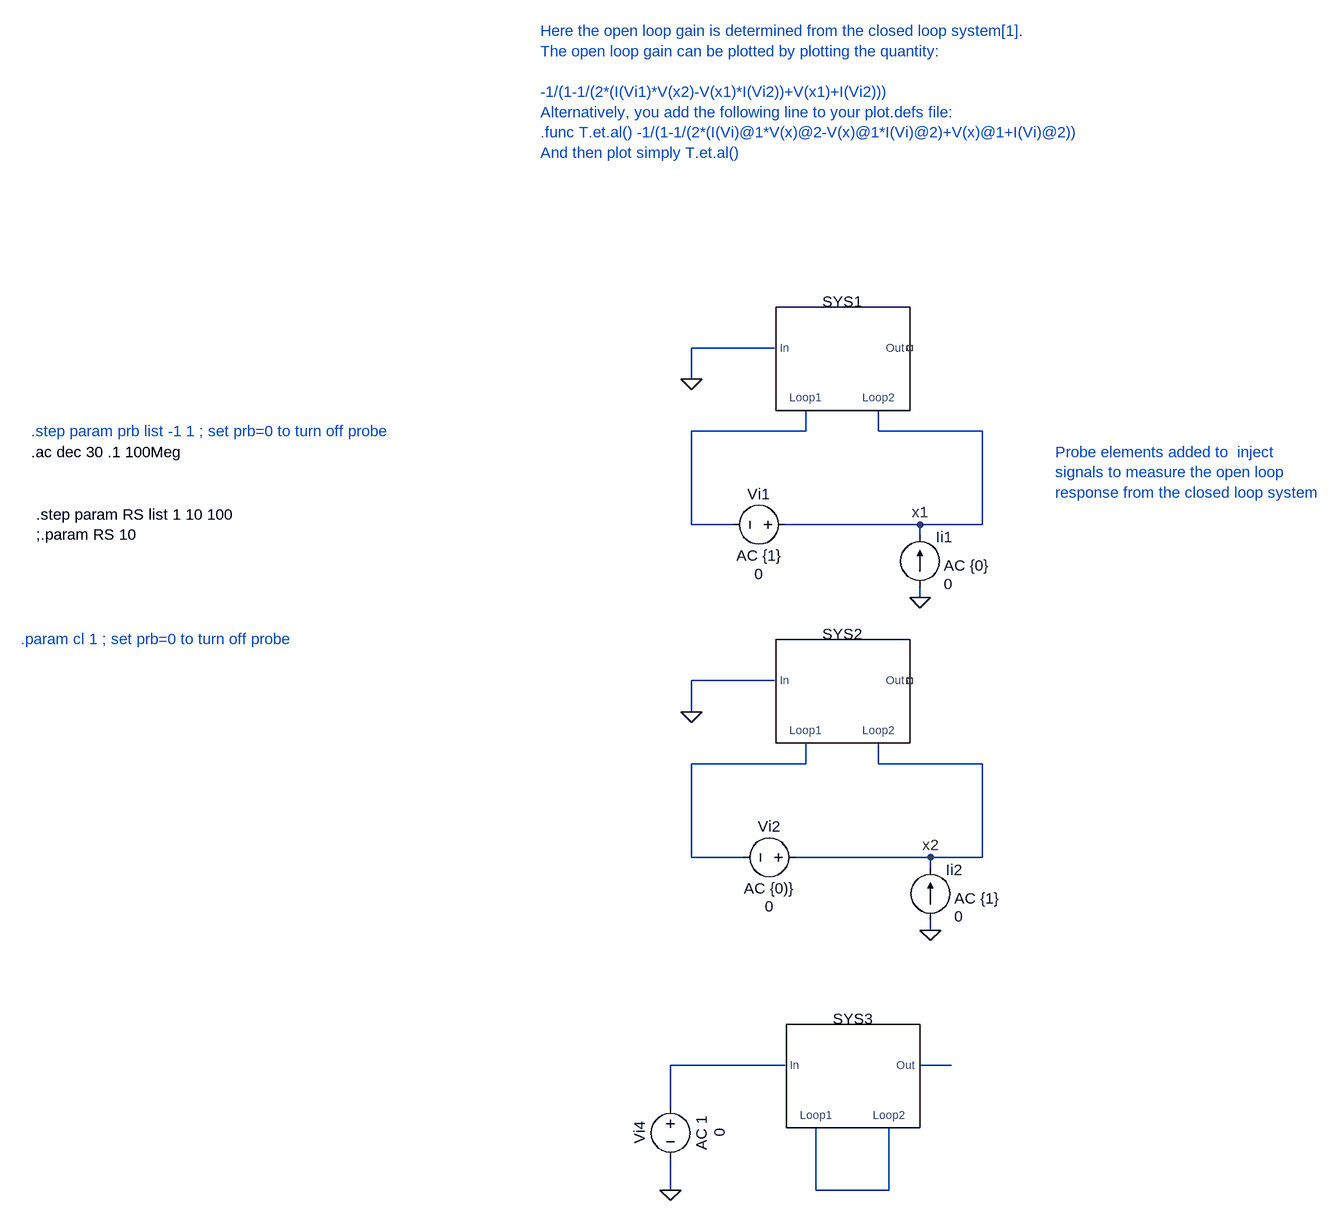
[diagram p0: schematic behavioral linear opamp stability 05.asc]
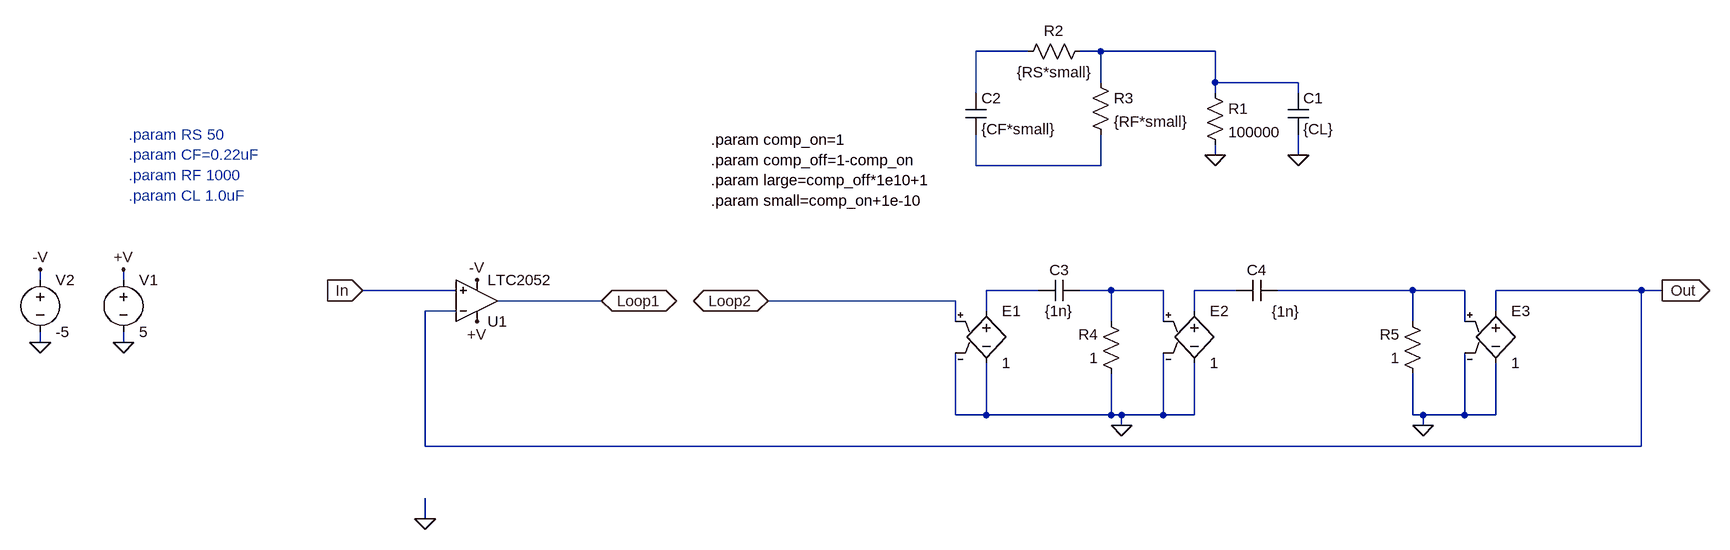
[diagram p1: sub-circuit system_model.asc]
behavioral linear opamp stability 05.asc, the LTspice schematic file:
Version 4
SHEET 1 1764 1540
WIRE -1472 32 -1600 32
WIRE -1600 80 -1600 32
WIRE -1424 160 -1424 128
WIRE -1424 160 -1600 160
WIRE -1312 160 -1312 128
WIRE -1152 160 -1312 160
WIRE -1600 304 -1600 160
WIRE -1536 304 -1600 304
WIRE -1248 304 -1456 304
WIRE -1152 304 -1152 160
WIRE -1152 304 -1248 304
WIRE -1248 320 -1248 304
WIRE -1248 416 -1248 400
WIRE -1472 544 -1600 544
WIRE -1600 592 -1600 544
WIRE -1424 672 -1424 640
WIRE -1424 672 -1600 672
WIRE -1312 672 -1312 640
WIRE -1152 672 -1312 672
WIRE -1600 816 -1600 672
WIRE -1520 816 -1600 816
WIRE -1232 816 -1440 816
WIRE -1152 816 -1152 672
WIRE -1152 816 -1232 816
WIRE -1232 832 -1232 816
WIRE -1232 928 -1232 912
WIRE -1456 1136 -1632 1136
WIRE -1200 1136 -1248 1136
WIRE -1632 1200 -1632 1136
WIRE -1632 1328 -1632 1280
WIRE -1408 1328 -1408 1232
WIRE -1296 1328 -1296 1232
WIRE -1296 1328 -1408 1328
FLAG -1248 416 0
FLAG -1248 304 x1
FLAG -1232 928 0
FLAG -1232 816 x2
FLAG -1600 80 0
FLAG -1600 592 0
FLAG -1632 1328 0
SYMBOL current -1248 400 M180
WINDOW 0 24 77 Left 2
WINDOW 3 37 5 Left 2
WINDOW 123 37 33 Left 2
WINDOW 39 0 0 Left 2
SYMATTR InstName Ii1
SYMATTR Value 0
SYMATTR Value2 AC {0}
SYMBOL voltage -1440 304 M270
WINDOW 0 32 56 VTop 2
WINDOW 3 -60 56 VBottom 2
WINDOW 123 -32 56 VBottom 2
WINDOW 39 -32 56 VBottom 2
SYMATTR InstName Vi1
SYMATTR Value 0
SYMATTR Value2 AC {1}
SYMBOL current -1232 912 M180
WINDOW 0 24 77 Left 2
WINDOW 3 37 5 Left 2
WINDOW 123 37 33 Left 2
WINDOW 39 0 0 Left 2
SYMATTR InstName Ii2
SYMATTR Value 0
SYMATTR Value2 AC {1}
SYMBOL voltage -1424 816 M270
WINDOW 0 32 56 VTop 2
WINDOW 3 -60 56 VBottom 2
WINDOW 123 -32 56 VBottom 2
WINDOW 39 -32 56 VBottom 2
SYMATTR InstName Vi2
SYMATTR Value 0
SYMATTR Value2 AC {0)}
SYMBOL system_model -1376 32 R0
SYMATTR InstName SYS1
SYMBOL system_model -1376 544 R0
SYMATTR InstName SYS2
SYMBOL system_model -1360 1136 R0
SYMATTR InstName SYS3
SYMBOL voltage -1632 1184 M0
WINDOW 0 32 56 VTop 2
WINDOW 3 -60 56 VBottom 2
WINDOW 123 -32 56 VBottom 2
WINDOW 39 -32 56 VBottom 2
SYMATTR InstName Vi4
SYMATTR Value 0
SYMATTR Value2 AC 1
TEXT -2616 192 Left 2 !.ac dec 30 .1 100Meg
TEXT -1832 -456 Left 2 ;Here the open loop gain is determined from the closed loop system[1].\nThe open loop gain can be plotted by plotting the quantity:\n \n-1/(1-1/(2*(I(Vi1)*V(x2)-V(x1)*I(Vi2))+V(x1)+I(Vi2)))\nAlternatively, you add the following line to your plot.defs file:\n.func T.et.al() -1/(1-1/(2*(I(Vi)@1*V(x)@2-V(x)@1*I(Vi)@2)+V(x)@1+I(Vi)@2))\nAnd then plot simply T.et.al()
TEXT -2616 160 Left 2 ;.step param prb list -1 1 ; set prb=0 to turn off probe
TEXT -1040 192 Left 2 ;Probe elements added to  inject\nsignals to measure the open loop\nresponse from the closed loop system
TEXT -2608 288 Left 2 !.step param RS list 1 10 100\n;.param RS 10
TEXT -2632 480 Left 2 ;.param cl 1 ; set prb=0 to turn off probe

system_model.asc, the sub-circuit schematic file:
Version 4
SHEET 1 1620 680
WIRE 544 -368 464 -368
WIRE 656 -368 624 -368
WIRE 832 -368 656 -368
WIRE 656 -320 656 -368
WIRE 832 -320 832 -368
WIRE 960 -320 832 -320
WIRE 464 -304 464 -368
WIRE 832 -304 832 -320
WIRE 960 -304 960 -320
WIRE 832 -208 832 -224
WIRE 960 -208 960 -240
WIRE 464 -192 464 -240
WIRE 656 -192 656 -240
WIRE 656 -192 464 -192
WIRE -976 -16 -976 -32
WIRE -848 -16 -848 -32
WIRE -336 0 -480 0
WIRE 560 0 480 0
WIRE 672 0 624 0
WIRE 752 0 672 0
WIRE 864 0 800 0
WIRE 1136 0 928 0
WIRE 1216 0 1136 0
WIRE 1488 0 1264 0
WIRE 1520 0 1488 0
WIRE -112 16 -272 16
WIRE 432 16 144 16
WIRE -336 32 -384 32
WIRE 480 32 480 0
WIRE 800 32 800 0
WIRE 1264 32 1264 0
WIRE 432 48 432 16
WIRE 672 48 672 0
WIRE 752 48 752 0
WIRE 1136 48 1136 0
WIRE 1216 48 1216 0
WIRE -976 80 -976 64
WIRE -848 80 -848 64
WIRE 432 192 432 96
WIRE 480 192 480 112
WIRE 480 192 432 192
WIRE 672 192 672 128
WIRE 672 192 480 192
WIRE 688 192 672 192
WIRE 752 192 752 96
WIRE 752 192 688 192
WIRE 800 192 800 112
WIRE 800 192 752 192
WIRE 1136 192 1136 128
WIRE 1152 192 1136 192
WIRE 1216 192 1216 96
WIRE 1216 192 1152 192
WIRE 1264 192 1264 112
WIRE 1264 192 1216 192
WIRE 688 208 688 192
WIRE 1152 208 1152 192
WIRE -384 240 -384 32
WIRE 1488 240 1488 0
WIRE 1488 240 -384 240
WIRE -384 352 -384 320
FLAG 832 -208 0
FLAG 960 -208 0
FLAG -304 -16 -V
FLAG -304 48 +V
FLAG -384 352 0
FLAG -112 16 Loop1
IOPIN -112 16 BiDir
FLAG 144 16 Loop2
IOPIN 144 16 BiDir
FLAG -480 0 In
IOPIN -480 0 In
FLAG 1520 0 Out
IOPIN 1520 0 Out
FLAG -848 80 0
FLAG -848 -32 +V
FLAG -976 80 0
FLAG -976 -32 -V
FLAG 688 208 0
FLAG 1152 208 0
SYMBOL res 816 -320 R0
SYMATTR InstName R1
SYMATTR Value 100000
SYMBOL cap 944 -304 R0
SYMATTR InstName C1
SYMATTR Value {CL}
SYMBOL res 640 -384 R90
WINDOW 0 0 56 VBottom 2
WINDOW 3 32 56 VTop 2
SYMATTR InstName R2
SYMATTR Value {RS*small}
SYMBOL Opamps\\LTC2052 -304 16 M180
SYMATTR InstName U1
SYMBOL cap 448 -304 R0
SYMATTR InstName C2
SYMATTR Value {CF*small}
SYMBOL res 640 -336 R0
SYMATTR InstName R3
SYMATTR Value {RF*small}
SYMBOL voltage -848 -32 R0
SYMATTR InstName V1
SYMATTR Value 5
SYMBOL voltage -976 -32 R0
SYMATTR InstName V2
SYMATTR Value -5
SYMBOL res 688 144 R180
WINDOW 0 36 76 Left 2
WINDOW 3 36 40 Left 2
SYMATTR InstName R4
SYMATTR Value 1
SYMBOL cap 624 -16 R90
WINDOW 0 0 32 VBottom 2
WINDOW 3 32 32 VTop 2
SYMATTR InstName C3
SYMATTR Value {1n}
SYMBOL e 480 16 R0
SYMATTR InstName E1
SYMATTR Value 1
SYMBOL e 800 16 R0
SYMATTR InstName E2
SYMATTR Value 1
SYMBOL res 1152 144 R180
WINDOW 0 36 76 Left 2
WINDOW 3 36 40 Left 2
SYMATTR InstName R5
SYMATTR Value 1
SYMBOL cap 928 -16 R90
WINDOW 0 0 32 VBottom 2
WINDOW 3 33 -13 VTop 2
SYMATTR InstName C4
SYMATTR Value {1n}
SYMBOL e 1264 16 R0
SYMATTR InstName E3
SYMATTR Value 1
TEXT 56 -232 Left 2 !.param comp_on=1\n.param comp_off=1-comp_on\n.param large=comp_off*1e10+1\n.param small=comp_on+1e-10
TEXT -840 -240 Left 2 ;.param RS 50\n.param CF=0.22uF\n.param RF 1000\n.param CL 1.0uF

The netlist it stands for:
* behavioral linear opamp stability 05.asc
Ii1 0 x1 0 AC {0}
Vi1 x1 N001 0 AC {1}
Ii2 0 x2 0 AC {1}
Vi2 x2 N002 0 AC {0)}
XSYS1 0 N001 x1 NC_01 system_model
XSYS2 0 N002 x2 NC_02 system_model
XSYS3 N003 N005 N005 N004 system_model
Vi4 N003 0 0 AC 1

* block symbol definitions
.subckt system_model In Loop1 Loop2 Out
R1 N002 0 100000
C1 N002 0 {CL}
R2 N002 N001 {RS*small}
* U1: LTC2052 (symbol Opamps\LTC2052 not available, pins judged from their places): In+=In In-=Out V+=+V V-=-V OUT=Loop1
C2 N001 N003 {CF*small}
R3 N002 N003 {RF*small}
V1 +V 0 5
V2 -V 0 -5
R4 0 N005 1
C3 N005 N004 {1n}
E1 N004 0 Loop2 0 1
E2 N006 0 N005 0 1
R5 0 N007 1
C4 N007 N006 {1n}
E3 Out 0 N007 0 1
.param comp_on=1
.param comp_off=1-comp_on
.param large=comp_off*1e10+1
.param small=comp_on+1e-10
* .param RS 50
* .param CF=0.22uF
* .param RF 1000
* .param CL 1.0uF
.ends system_model

.ac dec 30 .1 100Meg
* Here the open loop gain is determined from the closed loop system[1].
* The open loop gain can be plotted by plotting the quantity:
* -1/(1-1/(2*(I(Vi1)*V(x2)-V(x1)*I(Vi2))+V(x1)+I(Vi2)))
* Alternatively, you add the following line to your plot.defs file:
* .func T.et.al() -1/(1-1/(2*(I(Vi)@1*V(x)@2-V(x)@1*I(Vi)@2)+V(x)@1+I(Vi)@2))
* And then plot simply T.et.al()
* .step param prb list -1 1 ; set prb=0 to turn off probe
* Probe elements added to  inject
* signals to measure the open loop
* response from the closed loop system
.step param RS list 1 10 100
;.param RS 10
* .param cl 1 ; set prb=0 to turn off probe
.backanno
.end